# Altium schematic sheet Adquisicion de señal y preamplificacion.SchDoc
size 400 x 400 mm; SheetNumber: 3
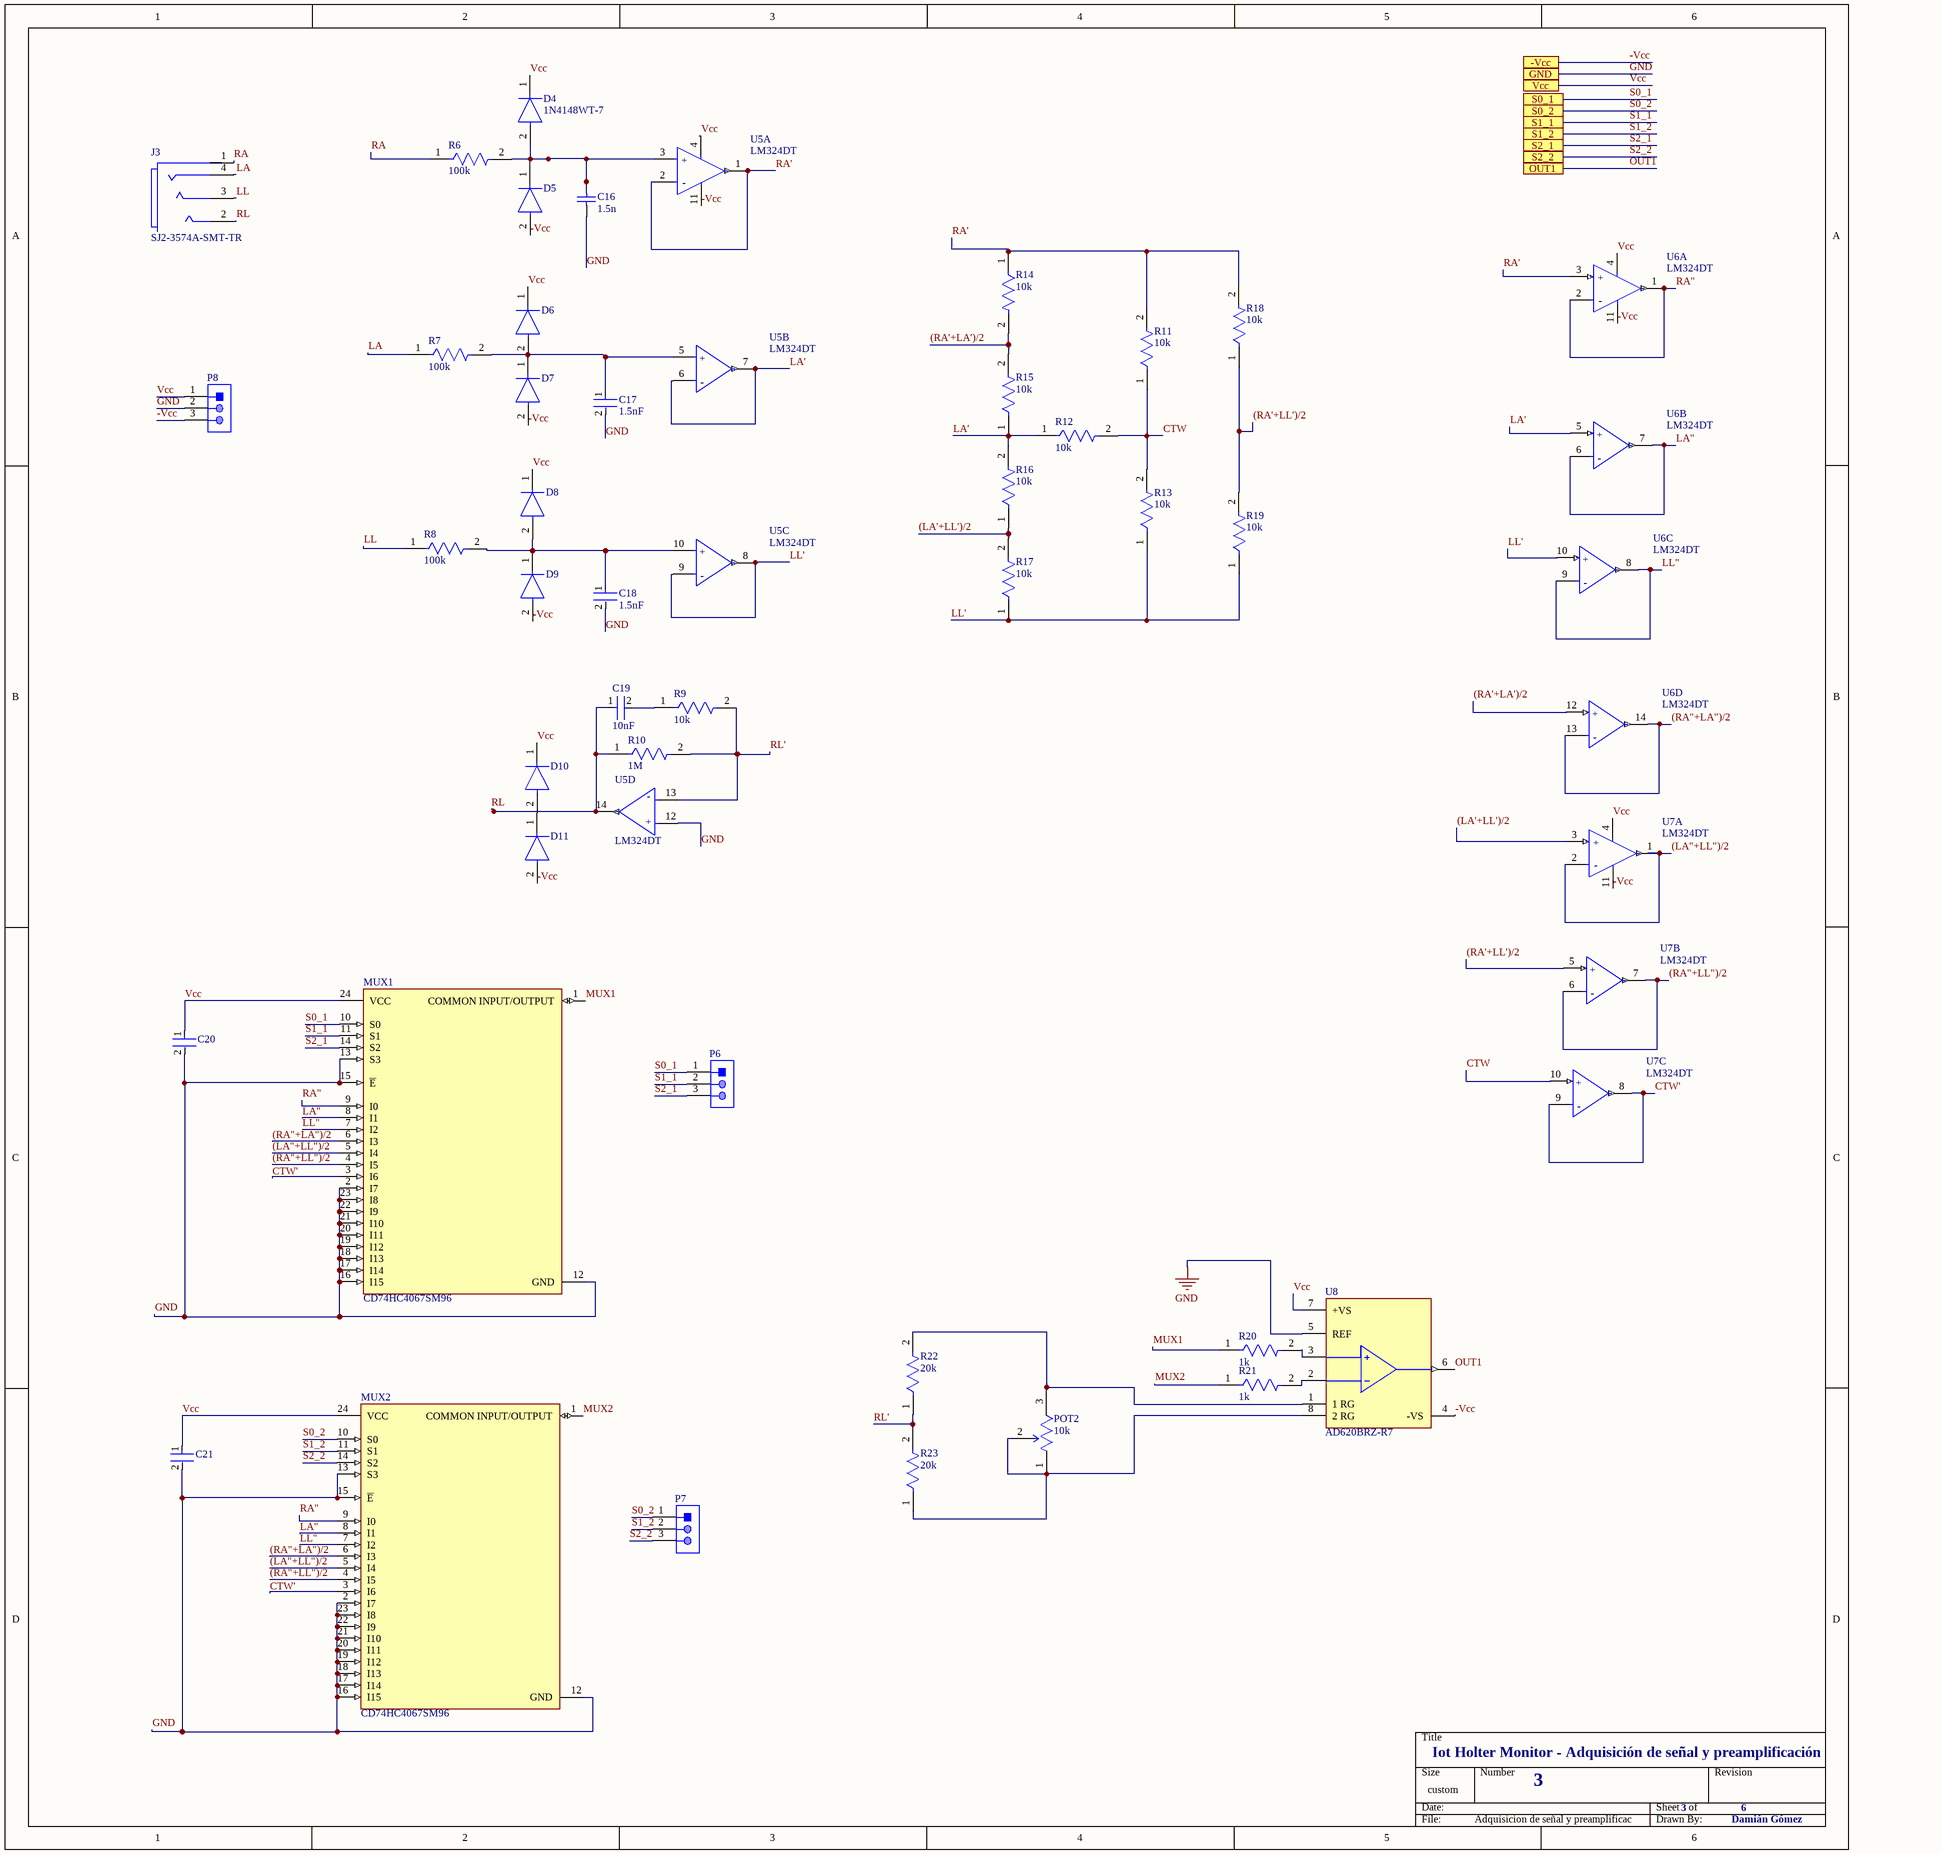
[diagram p0: Adquisicion de señal y preamplificacion.SchDoc]

## Parts
C16  1.5n  [KEMT-1206-2_M]
C17  1.5nF  [FP-CL31-IPC_C]
C18  1.5nF  [FP-CL31-IPC_C]
C19  10nF  [FP-CL31-IPC_C]
C20  (no value)  [FP-0603-L_1_6_0_15-W_0_81-IPC_A]
C21  (no value)  [FP-0603-L_1_6_0_15-W_0_81-IPC_A]
D4  1N4148WT-7  [FP-SOD523-MFG]
D5  1N4148WT-7  [FP-SOD523-MFG]  (value not drawn)
D6  1N4148WT-7  [FP-SOD523-MFG]  (value not drawn)
D7  1N4148WT-7  [FP-SOD523-MFG]  (value not drawn)
D8  1N4148WT-7  [FP-SOD523-MFG]  (value not drawn)
D9  1N4148WT-7  [FP-SOD523-MFG]  (value not drawn)
D10  1N4148WT-7  [FP-SOD523-MFG]  (value not drawn)
D11  1N4148WT-7  [FP-SOD523-MFG]  (value not drawn)
J3  SJ2-3574A-SMT-TR  [FP-SJ2-3574A-SMT-TR-MFG]
MUX1  CD74HC4067SM96  [FP-DB0024A-IPC_C]
MUX2  CD74HC4067SM96  [FP-DB0024A-IPC_C]
P6  640456-3  [TECO-640456-3]  (value not drawn)
P7  640456-3  [TECO-640456-3]  (value not drawn)
P8  640456-3  [TECO-640456-3]  (value not drawn)
POT2  10k  [FP-3296W-MFG]
R6  100k  [FP-RC3216-MFG]
R7  100k  [FP-RC3216-MFG]
R8  100k  [FP-RC3216-MFG]
R9  10k  [FP-RC3216-MFG]
R10  1M  [FP-RC3216-MFG]
R11  10k  [FP-RC3216-MFG]
R12  10k  [FP-RC3216-MFG]
R13  10k  [FP-RC3216-MFG]
R14  10k  [FP-RC3216-MFG]
R15  10k  [FP-RC3216-MFG]
R16  10k  [FP-RC3216-MFG]
R17  10k  [FP-RC3216-MFG]
R18  10k  [FP-RC3216-MFG]
R19  10k  [FP-RC3216-MFG]
R20  1k  [FP-RC3216-MFG]
R21  1k  [FP-RC3216-MFG]
R22  20k  [FP-RC3216-MFG]
R23  20k  [FP-RC3216-MFG]
U5  LM324DT  [FP-SO-14-MFG]  (parts A,B,C,D of 4)
U6  LM324DT  [FP-SO-14-MFG]  (parts A,B,C,D of 4)
U7  LM324DT  [FP-SO-14-MFG]  (parts A,B,C of 4)
U8  AD620BRZ-R7  [FP-R-8-IPC_C]

## Ports
-Vcc, GND, OUT1, S0_1, S0_2, S1_1, S1_2, S2_1, S2_2, Vcc

## Nets
GND: C16.1 C17.2 C18.2 C20.2 C21.2 MUX1.2(I7) MUX1.12(GND) MUX1.13(S3) MUX1.15(~{E}) MUX1.16(I15) MUX1.17(I14) MUX1.18(I13) MUX1.19(I12) MUX1.20(I11) MUX1.21(I10) MUX1.22(I9) MUX1.23(I8) MUX2.2(I7) MUX2.12(GND) MUX2.13(S3) MUX2.15(~{E}) MUX2.16(I15) MUX2.17(I14) MUX2.18(I13) MUX2.19(I12) MUX2.20(I11) MUX2.21(I10) MUX2.22(I9) MUX2.23(I8) P8.2 U5.12(Non-Inverting_Input_4) U8.5(REF) ; port GND
(LA"+LL")/2: MUX1.5(I4) MUX2.5(I4) U7.1(Output_1) U7.2(Inverting_Input_1)
(LA'+LL')/2: R16.1 R17.2 U7.3(Non-Inverting_Input_1)
(RA"+LA")/2: MUX1.6(I3) MUX2.6(I3) U6.13(Inverting_Input_4) U6.14(Output_4)
(RA"+LL")/2: MUX1.4(I5) MUX2.4(I5) U7.6(Inverting_Input_2) U7.7(Output_2)
(RA'+LA')/2: R14.2 R15.2 U6.12(Non-Inverting_Input_4)
(RA'+LL')/2: R18.1 R19.2 U7.5(Non-Inverting_Input_2)
-Vcc: D5.2(A) D7.2(A) D9.2(A) D11.2(A) P8.3 U5.11(VCC-) U6.11(VCC-) U7.11(VCC-) U8.4(-VS) ; port -Vcc
CTW: R11.1 R12.2 R13.2 U7.10(Non-Inverting_Input_3)
CTW': MUX1.3(I6) MUX2.3(I6) U7.8(Output_3) U7.9(Inverting_Input_3)
LA: J3.4(ring_2) R7.1
LA": MUX1.8(I1) MUX2.8(I1) U6.6(Inverting_Input_2) U6.7(Output_2)
LA': R12.1 R15.1 R16.2 U5.6(Inverting_Input_2) U5.7(Output_2) U6.5(Non-Inverting_Input_2)
LL: J3.3(ring_1) R8.1
LL": MUX1.7(I2) MUX2.7(I2) U6.8(Output_3) U6.9(Inverting_Input_3)
LL': R13.1 R17.1 R19.1 U5.8(Output_3) U5.9(Inverting_Input_3) U6.10(Non-Inverting_Input_3)
MUX1: MUX1.1(COMMON_INPUT/OUTPUT) R20.1
MUX2: MUX2.1(COMMON_INPUT/OUTPUT) R21.1
OUT1: U8.6(OUTPUT) ; port OUT1
RA: J3.1(sleeve) R6.1
RA": MUX1.9(I0) MUX2.9(I0) U6.1(Output_1) U6.2(Inverting_Input_1)
RA': R11.2 R14.1 R18.2 U5.1(Output_1) U5.2(Inverting_Input_1) U6.3(Non-Inverting_Input_1)
RL: C19.1 J3.2(tip) R10.1 U5.14(Output_4)
RL': R9.2 R10.2 R22.1 R23.2 U5.13(Inverting_Input_4)
S0_1: MUX1.10(S0) P6.1 ; port S0_1
S0_2: MUX2.10(S0) P7.1 ; port S0_2
S1_1: MUX1.11(S1) P6.2 ; port S1_1
S1_2: MUX2.11(S1) P7.2 ; port S1_2
S2_1: MUX1.14(S2) P6.3 ; port S2_1
S2_2: MUX2.14(S2) P7.3 ; port S2_2
Vcc: C20.1 C21.1 D4.1(C) D6.1(C) D8.1(C) D10.1(C) MUX1.24(VCC) MUX2.24(VCC) P8.1 U5.4(VCC+) U6.4(VCC+) U7.4(VCC+) U8.7(+VS) ; port Vcc
NetC16_2: C16.2 D4.2(A) D5.1(C) R6.2 U5.3(Non-Inverting_Input_1)
NetC17_1: C17.1 D6.2(A) D7.1(C) R7.2 U5.5(Non-Inverting_Input_2)
NetC18_1: C18.1 D8.2(A) D9.1(C) R8.2 U5.10(Non-Inverting_Input_3)
NetC19_2: C19.2 R9.1
NetD10_2: D10.2(A) D11.1(C)
NetPOT2_1: POT2.1(CCW) POT2.2(WIPER) R23.1 U8.8(2_RG)
NetPOT2_3: POT2.3(CW) R22.2 U8.1(1_RG)
NetR20_2: R20.2 U8.3(+IN)
NetR21_2: R21.2 U8.2(-IN)

## Notes on the sheet
- Iot Holter Monitor - Adquisición de señal y preamplificación
- 3
- 6
- Damián Gómez
- (in symbol CMP-12131-000005-1, part A) +; -
- (in symbol CMP-12131-000005-1, part B) +; -
- (in symbol CMP-12131-000005-1, part C) +; -
- (in symbol CMP-12131-000005-1, part D) -; +

## Library data of the parts
C16 = CMP-1037-04202-2: CAP, Ceramic, 0.1 uF, +/- 10%, 50 V, -55 to 125 degC, 1206 (3216 Metric), RoHS, Tape and Reel; Manufacturer: Kemet; Voltage Rating: 50V; Capacitance: 0.1µF; Product Range: KEMET-CSeries; SVHC: ToBeAdvised; Dielectric Characteristic: X7R; Capacitor Case Style: 1206[3216Metric]; Package Reference: 1206-2; Package Description: 2-Leads SMD, Body 3.2 x 1.6 mm; Packaging: Tape&Reel; Operating Temperature Max: 125degC; Capacitance Tolerance: ±10%; Datasheet URL: https://datasheet.ciiva.com/6125/1725438-6125494.pdf; Manufacturer URL: http://www.kemet.com/; Operating Temperature Min: -55degC; Datasheet Version: Jul-13
C17 C18 = CMP-13271-001211-1: Cap Ceramic 1.5nF 500V C0G ±5% SMD 1206 +125°C Embossed T/R; Capacitance: 220pF; Tolerance: 5%; Voltage Rating (DC): 500V; Depth: 1.6mm; Max Operating Temperature: 125°C; Width: 0.063inch; Radiation Hardening: No; Thickness: 0.055inch; Packaging: Tape and Reel; Height: 1.25mm; Case/Package: 1206; Package Quantity: 10000; Dielectric: C0G; Mount: Surface Mount; Voltage Rating: 500V; Min Operating Temperature: -55°C; Length: 3.2mm
C19 = CMP-13271-001211-1: Cap Ceramic 10nF 500V C0G ±5% SMD 1206 +125°C Embossed T/R; Capacitance: 220pF; Tolerance: 5%; Voltage Rating (DC): 500V; Depth: 1.6mm; Max Operating Temperature: 125°C; Width: 0.063inch; Radiation Hardening: No; Thickness: 0.055inch; Packaging: Tape and Reel; Height: 1.25mm; Case/Package: 1206; Package Quantity: 10000; Dielectric: C0G; Mount: Surface Mount; Voltage Rating: 500V; Min Operating Temperature: -55°C; Length: 3.2mm
C20 C21 = CMP-2006-04378-2: General Purpose Ceramic Capacitor, 0603, 1nF, 10%, X7R, 15%, 50V; Case Code (Metric): 1608; Min Operating Temperature: -55°C; Weight: 7.1E-05oz; Series: -; Capacitance: 1nF; RoHS Compliant: Yes; Radiation Hardening: No; Height: 0.9mm; Mount: Surface Mount; REACH SVHC: No SVHC; Lead Free: Lead Free; Depth: 0.81mm; Voltage: 50V; Number of Pins: 2; Voltage Rating: 50V; Max Operating Temperature: 125°C; Termination: SMD/SMT; Construction: Flat; Case Code (Imperial): 0603; Dielectric: X7R; Width: 0.032inch; Tolerance: 10%; Case/Package: 0603; Contact Plating: Tin; Packaging: Tape and Reel; Voltage Rating (DC): 50V; Dielectric Material: Ceramic; Package Quantity: 4000; Thickness: 0.035inch; Length: 1.6mm
D4-D11 = CMP-2000-05518-3: DIODE GEN PURP 80V 125MA SOD523; Power Rating: 150mW; Peak Non-Repetitive Surge Current: 2A; Forward Voltage: 1.25V; Reverse Recovery Time: 4ns; Peak Reverse Current: 1uA; Max Repetitive Reverse Voltage (Vrrm): 100V; Capacitance: 2pF; Polarity: Standard; Element Configuration: Single; Forward Current: 250mA; Lead Free: Lead Free; Packaging: Tape and Reel; Length: 0.9mm; Min Operating Temperature: -65°C; Current Rating: 125mA; Max Reverse Voltage (DC): 80V; Width: 1.3mm; Package Quantity: 3000; Output Current: 125mA; Power Dissipation: 150mW; Max Operating Temperature: 150°C; Radiation Hardening: No; Average Rectified Current: 125mA; Height: 0.65mm; Voltage Rating (DC): 80V; Max Surge Current: 2A; Weight: 3.5E-05oz; Recovery Time: 4ns; Max Forward Surge Current (Ifsm): 2A; Contact Plating: Tin; Number of Pins: 2; Mount: Surface Mount; REACH SVHC: No SVHC
J3 = CMP-14818-000001-1: AUDIO JACK, 3.5 MM, RT, 4 CONDUC; Manufacturer: CUI; Conn Orientation: Horizontal; Current Rating: 1A; Number Of Contacts: 4; Voltage Rating: 12V; Package: SJ2-3574A-SMT-TR; Device Class L1: Connectors; Lead Free: Yes; Digikey Description: AUDIO JACK, 3.5 MM, RT, 4 CONDUC; Device Class L2: Audio / Video Connectors; ComponentLink2URL: https://www.cui.com/product/resource/sj2-357x-smt.pdf; Automotive: No; RoHS: TRUE; Height: 5.3mm; Temperature Range Low: -25°C; Category: Conn; Temperature: -25°C to +85°C; Octopart: https://octopart.com/sj2-3574a-smt-tr-cui-77838840; Device Class L3: unset; Contact Material: Silver; Manufacturer Part Number: SJ2-3574A-SMT-TR; Temperature Range High: +85°C; ComponentLink2Description: Datasheet
MUX1 MUX2 = CMP-04892-000038-1: IC MUX/DEMUX 1X16 24SSOP; Supply Type: Single; High Level Output Current: 25mA; Min Supply Voltage: 2V; Number of Circuits: 16; Max Supply Voltage: 6V; Number of Channels: 1; Turn-On Delay Time: 300ns; Max Supply Current: 8uA; Bandwidth: 89MHz; Turn-Off Delay Time: 290ns; Propagation Delay: 75ns; Logic Function: Multiplexer; On-State Resistance: 160R; Polarity: Non-Inverting; Width: 5.3mm; Case/Package: SSOP; Max Operating Temperature: 125°C; Mount: Surface Mount; Min Operating Temperature: -55°C; REACH SVHC: No SVHC; Contact Plating: Gold; Max Output Current: 25mA; Weight: 0.006081oz; Height: 1.95mm; Package Quantity: 2000; Length: 8.2mm; Lead Free: Lead Free; Operating Supply Current: 8uA; Packaging: Tape and Reel; Series: 74HC; Low Level Output Current: 25mA; Number of Outputs: 1; Termination: SMD/SMT; Number of Inputs: 16; Number of Bits: 16; Radiation Hardening: No; Number of Pins: 24
P6-P8 = CMP-2000-05418-1: Male Header, Pitch 2.54 mm, 1 x 3 Position, Height 10.03 mm, Tail Length 3.56 mm, -55 to 105 degC; Manufacturer: TE Connectivity; Agency Approvals: CSA,UL; Angle: Straight; Number of Positions: 3; Standards: RoHSCompliant,ELVCompliant,UL94V-0; Current, Rating: 5 / A; Connector Type: MTA-100; Mount Angle: Vertical; Material, Housing: Polyester; Temperature, Operating: -55to+105 / degC; Voltage, Rating: 250 / V; Color, Housing: White; Contact Centerline Spacing: 0.100 / in.; Special Features: Pinstrip; Material, Contact: CopperAlloy; Contact Termination Area Plating: Tin; Primary Type: InterconnectSystem; Pin Spacing: 0.1 / "; Brand/Series: MTA-100Series; Mounting Hole Size: 0.04 / "; Manufacturer URL: http://www.te.com/; Datasheet URL: https://datasheet.ciiva.com/16456/eng-ds-82056-mta-0608-16456886.pdf; Flammability Rating: UL94V-0; Mounting Type: PCMount; Contact Mating Area Plating: Tin; Datasheet Version: Jun-08; Number of Rows: 1; Termination: Solder; Type: PCBPlug; Length, Pin: 0.14 / "; Color: White; Contact Plating: Tin; Contact Shape: Square; Number of Contacts: 3; Size, Post: 0.025 / in.; Length, Terminal Post: 0.14 / in.; Length, Overall: 0.3 / "
POT2 = CMP-07234-000024-1: TRIMMER 10K OHM 0.5W PC PIN TOP; Resistance: 10kR; Temperature Coefficient: 100ppm/°C; Power Rating: 500mW; Tolerance: 10%; Number of Turns: 25; Width: 0.19inch; Termination: Pin; Radiation Hardening: No; Contact Plating: Tin; Composition: Cermet; Length: 9.53mm; Height: 0.395inch; Depth: 4.83mm; REACH SVHC: No SVHC; Weight: 0.03oz; Min Operating Temperature: -55°C; Military Standard: Not; Max Operating Temperature: 125°C; Packaging: Tape and Reel; Package Quantity: 1; Taper: Linear; Max Power Dissipation: 500mW; Mount: Through Hole
R6-R8 R20 R21 = CMP-13261-001932-1: Res Thick Film 1206 1kΩ 5% 0.25W ±100ppm/°C Molded SMD T/R; Max Power Dissipation: 250mW; Resistance: 1kR; Voltage Rating (DC): 200V; Width: 0.063inch; Length: 0.126inch; Min Operating Temperature: -55°C; Packaging: Tape and Reel; Case Code (Metric): 3216; Contact Plating: Tin; Composition: Thick Film; Military Standard: Not; Depth: 1.6mm; Lead Free: Lead Free; Height: 0.026inch; Case Code (Imperial): 1206; Number of Terminations: 2; Radiation Hardening: No; Case/Package: 1206; Features: Moisture Resistant; Power Rating: 250mW; Max Operating Temperature: 155°C; Tolerance: 5%; Temperature Coefficient: 100ppm/°C
R9 R11-R19 = CMP-13261-001932-1: Res Thick Film 1206 10kΩ 5% 0.25W ±100ppm/°C Molded SMD T/R; Max Power Dissipation: 250mW; Resistance: 1kR; Voltage Rating (DC): 200V; Width: 0.063inch; Length: 0.126inch; Min Operating Temperature: -55°C; Packaging: Tape and Reel; Case Code (Metric): 3216; Contact Plating: Tin; Composition: Thick Film; Military Standard: Not; Depth: 1.6mm; Lead Free: Lead Free; Height: 0.026inch; Case Code (Imperial): 1206; Number of Terminations: 2; Radiation Hardening: No; Case/Package: 1206; Features: Moisture Resistant; Power Rating: 250mW; Max Operating Temperature: 155°C; Tolerance: 5%; Temperature Coefficient: 100ppm/°C
R10 = CMP-13261-001932-1: Res Thick Film 1206 1MΩ 5% 0.25W ±100ppm/°C Molded SMD T/R; Max Power Dissipation: 250mW; Resistance: 1kR; Voltage Rating (DC): 200V; Width: 0.063inch; Length: 0.126inch; Min Operating Temperature: -55°C; Packaging: Tape and Reel; Case Code (Metric): 3216; Contact Plating: Tin; Composition: Thick Film; Military Standard: Not; Depth: 1.6mm; Lead Free: Lead Free; Height: 0.026inch; Case Code (Imperial): 1206; Number of Terminations: 2; Radiation Hardening: No; Case/Package: 1206; Features: Moisture Resistant; Power Rating: 250mW; Max Operating Temperature: 155°C; Tolerance: 5%; Temperature Coefficient: 100ppm/°C
R22 R23 = CMP-13261-001932-1: Res Thick Film 1206 20kΩ 5% 0.25W ±100ppm/°C Molded SMD T/R; Max Power Dissipation: 250mW; Resistance: 1kR; Voltage Rating (DC): 200V; Width: 0.063inch; Length: 0.126inch; Min Operating Temperature: -55°C; Packaging: Tape and Reel; Case Code (Metric): 3216; Contact Plating: Tin; Composition: Thick Film; Military Standard: Not; Depth: 1.6mm; Lead Free: Lead Free; Height: 0.026inch; Case Code (Imperial): 1206; Number of Terminations: 2; Radiation Hardening: No; Case/Package: 1206; Features: Moisture Resistant; Power Rating: 250mW; Max Operating Temperature: 155°C; Tolerance: 5%; Temperature Coefficient: 100ppm/°C
U5-U7 = CMP-12131-000005-1: IC OPAMP GP 4 CIRCUIT 14SO; Manufacturer: STMicroelectronics; Voltage Gain: 100dB; Standoff Height: 0.1mm; Bandwidth: 1.3MHz; Max Junction Temp: +150°C; Min Supply Voltage: 3V; Max Dual Supply Voltage: 15V; Min Dual Supply Voltage: 1.5V; Number Of Channels: 4; Nominal Supply Current: 0.7-1.5mA; Output Current Per Channel: 20-50mA; Max Supply Voltage: 30V; Input Offset Voltage: 2mV; Input Bias Current: 0.02uA; Device Class L1: Integrated Circuits (ICs); Device Class L3: Amplifiers - Op Amps; Temperature Range Low: 0°C; Package: SO-14; Temperature Range High: +70°C; Digikey Description: IC OPAMP GP 4 CIRCUIT 14SO; Device Class L2: Linear ICs; Footprint Url: https://www.st.com/content/ccc/resource/technical/document/datasheet/group3/10/8a/e6/12/f8/e8/49/ce/DM00366438/files/DM00366438.pdf/jcr:content/translations/en.DM00366438.pdf; Octopart: https://octopart.com/lm324dt-stmicroelectronics-39579146; ComponentLink2URL: https://www.st.com/content/ccc/resource/technical/document/datasheet/bd/fc/46/43/26/8f/40/7f/CD00001046.pdf/files/CD00001046.pdf/jcr:content/translations/en.CD00001046.pdf; ComponentLink2Description: Datasheet; Lead Free: Yes; Temperature: 0°C to +70°C; RoHS: TRUE; Gain Bandwidth: 1.3MHz; Manufacturer Part Number: LM324DT; Automotive: No; Category: IC; Height: 1.75mm; Mouser Description: LM324 Series 32 V 1.3 MHz Low Power Quad Operational Amplifier - SOIC-14
U8 = CMP-09116-000394-1: IC INST AMP 1 CIRCUIT 8SOIC; Operating Supply Voltage: 18V; Max Power Dissipation: 650mW; Operating Supply Current: 1.3mA; Number of Channels: 1; Amplifier Type: INSTRUMENTATION AMPLIFIER; Input Offset Voltage (Vos): 30mV; Min Supply Voltage: 4.6V; Output Current per Channel: 18mA; Input Resistance: 10GR; Min Dual Supply Voltage: 2.3V; Common Mode Rejection Ratio: 93dB; Slew Rate: 1.2V/µs; -3db Bandwidth: 1MHz; Input Bias Current: 1nA; Number of Pins: 8; Case/Package: SOIC; Lead Free: Contains Lead; Max Operating Temperature: 125°C; Package Quantity: 1; Radiation Hardening: No; Contact Plating: Tin; Mount: Surface Mount; Min Operating Temperature: -55°C; Power Dissipation: 650mW; Nominal Supply Current: 1.3mA; Packaging: Tape and Reel; Number of Circuits: 1; RoHS Compliant: Yes; Number of Elements: 1; Max Dual Supply Voltage: 18V; Series: -